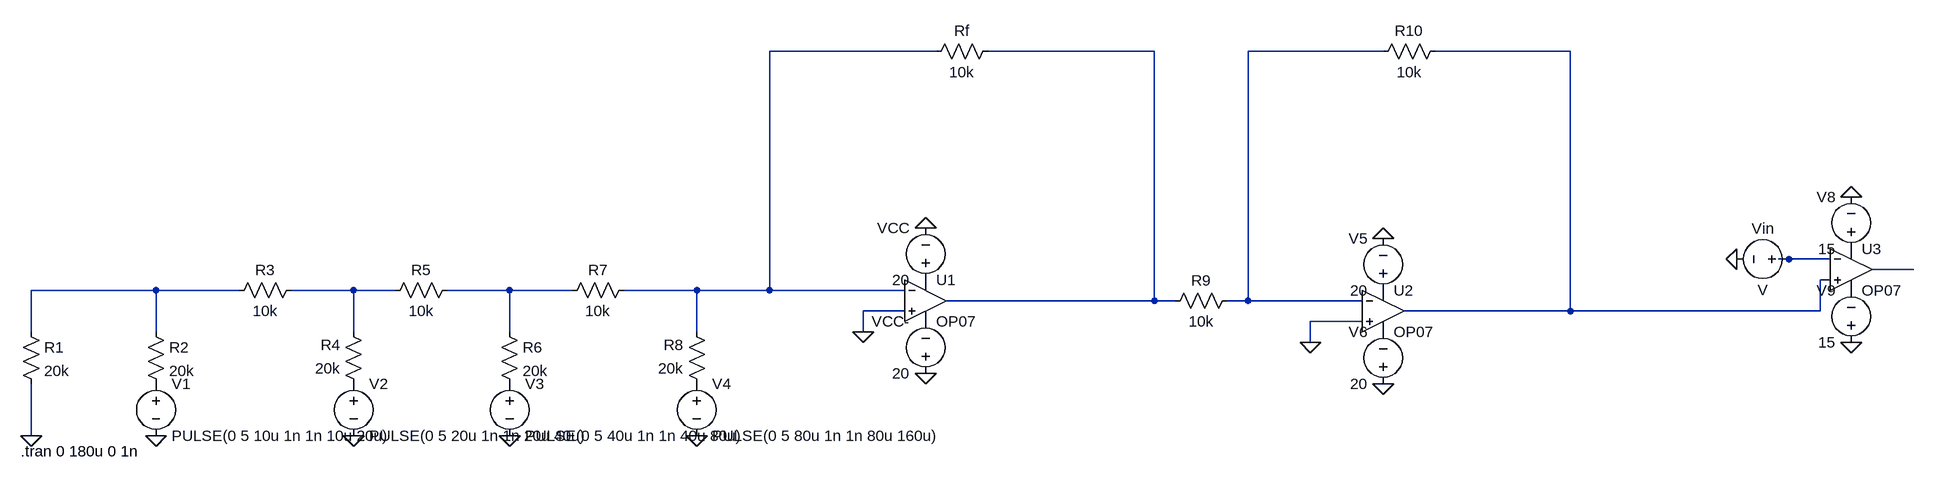
[diagram p0: schematic DAC.asc]
DAC.asc, the LTspice schematic file:
Version 4
SHEET 1 2836 680
WIRE 1328 -224 1072 -224
WIRE 1664 -224 1408 -224
WIRE 2016 -224 1808 -224
WIRE 2304 -224 2096 -224
WIRE 2640 96 2624 96
WIRE 2704 96 2640 96
WIRE 2832 112 2768 112
WIRE 2704 128 2688 128
WIRE 128 144 -64 144
WIRE 256 144 128 144
WIRE 432 144 336 144
WIRE 496 144 432 144
WIRE 672 144 576 144
WIRE 768 144 672 144
WIRE 960 144 848 144
WIRE 1072 144 1072 -224
WIRE 1072 144 960 144
WIRE 1280 144 1072 144
WIRE 1664 160 1664 -224
WIRE 1664 160 1344 160
WIRE 1696 160 1664 160
WIRE 1808 160 1808 -224
WIRE 1808 160 1776 160
WIRE 1984 160 1808 160
WIRE 1280 176 1216 176
WIRE 2304 176 2304 -224
WIRE 2304 176 2048 176
WIRE 2688 176 2688 128
WIRE 2688 176 2304 176
WIRE 1984 192 1904 192
WIRE -64 208 -64 144
WIRE 128 208 128 144
WIRE 432 208 432 144
WIRE 672 208 672 144
WIRE 960 208 960 144
WIRE 1216 208 1216 176
WIRE 1904 224 1904 192
WIRE -64 368 -64 288
FLAG -64 368 0
FLAG 1216 208 0
FLAG 1312 48 0
FLAG 1312 272 0
FLAG 128 368 0
FLAG 432 368 0
FLAG 672 368 0
FLAG 960 368 0
FLAG 1904 224 0
FLAG 2016 64 0
FLAG 2016 288 0
FLAG 2736 0 0
FLAG 2736 224 0
FLAG 2560 96 0
DATAFLAG 1072 144 ""
DATAFLAG 1664 160 ""
DATAFLAG 672 144 ""
DATAFLAG 432 144 ""
DATAFLAG 128 144 ""
DATAFLAG 1664 160 ""
DATAFLAG 1664 160 ""
SYMBOL res -80 192 R0
SYMATTR InstName R1
SYMATTR Value 20k
SYMBOL res 112 192 R0
SYMATTR InstName R2
SYMATTR Value 20k
SYMBOL res 352 128 R90
WINDOW 0 0 56 VBottom 2
WINDOW 3 32 56 VTop 2
SYMATTR InstName R3
SYMATTR Value 10k
SYMBOL res 448 304 R180
WINDOW 0 36 76 Left 2
WINDOW 3 36 40 Left 2
SYMATTR InstName R4
SYMATTR Value 20k
SYMBOL res 480 160 R270
WINDOW 0 32 56 VTop 2
WINDOW 3 0 56 VBottom 2
SYMATTR InstName R5
SYMATTR Value 10k
SYMBOL res 656 192 R0
SYMATTR InstName R6
SYMATTR Value 20k
SYMBOL res 864 128 R90
WINDOW 0 0 56 VBottom 2
WINDOW 3 32 56 VTop 2
SYMATTR InstName R7
SYMATTR Value 10k
SYMBOL res 976 304 R180
WINDOW 0 36 76 Left 2
WINDOW 3 36 40 Left 2
SYMATTR InstName R8
SYMATTR Value 20k
SYMBOL OpAmps\\OP07 1312 96 R0
SYMATTR InstName U1
SYMBOL voltage 1312 144 R180
WINDOW 0 24 96 Left 2
WINDOW 3 24 16 Left 2
SYMATTR InstName VCC
SYMATTR Value 20
SYMBOL voltage 1312 288 R180
WINDOW 0 24 96 Left 2
WINDOW 3 24 16 Left 2
SYMATTR InstName VCC-
SYMATTR Value 20
SYMBOL res 1424 -240 R90
WINDOW 0 0 56 VBottom 2
WINDOW 3 32 56 VTop 2
SYMATTR InstName Rf
SYMATTR Value 10k
SYMBOL voltage 128 272 R0
WINDOW 123 0 0 Left 0
WINDOW 39 0 0 Left 0
SYMATTR InstName V1
SYMATTR Value PULSE(0 5 10u 1n 1n 10u 20u)
SYMBOL voltage 432 272 R0
WINDOW 123 0 0 Left 0
WINDOW 39 0 0 Left 0
SYMATTR InstName V2
SYMATTR Value PULSE(0 5 20u 1n 1n 20u 40u)
SYMBOL voltage 672 272 R0
WINDOW 123 0 0 Left 0
WINDOW 39 0 0 Left 0
SYMATTR InstName V3
SYMATTR Value PULSE(0 5 40u 1n 1n 40u 80u)
SYMBOL voltage 960 272 R0
WINDOW 123 0 0 Left 0
WINDOW 39 0 0 Left 0
SYMATTR InstName V4
SYMATTR Value PULSE(0 5 80u 1n 1n 80u 160u)
SYMBOL OpAmps\\OP07 2016 112 R0
SYMATTR InstName U2
SYMBOL voltage 2016 160 R180
WINDOW 0 24 96 Left 2
WINDOW 3 24 16 Left 2
SYMATTR InstName V5
SYMATTR Value 20
SYMBOL voltage 2016 304 R180
WINDOW 0 24 96 Left 2
WINDOW 3 24 16 Left 2
SYMATTR InstName V6
SYMATTR Value 20
SYMBOL res 1792 144 R90
WINDOW 0 0 56 VBottom 2
WINDOW 3 32 56 VTop 2
SYMATTR InstName R9
SYMATTR Value 10k
SYMBOL res 2112 -240 R90
WINDOW 0 0 56 VBottom 2
WINDOW 3 32 56 VTop 2
SYMATTR InstName R10
SYMATTR Value 10k
SYMBOL OpAmps\\OP07 2736 48 R0
SYMATTR InstName U3
SYMBOL voltage 2736 96 R180
WINDOW 0 24 96 Left 2
WINDOW 3 24 16 Left 2
WINDOW 123 0 0 Left 0
WINDOW 39 0 0 Left 0
SYMATTR InstName V8
SYMATTR Value 15
SYMBOL voltage 2736 240 R180
WINDOW 0 24 96 Left 2
WINDOW 3 24 16 Left 2
SYMATTR InstName V9
SYMATTR Value 15
SYMBOL voltage 2656 96 R90
WINDOW 0 -32 56 VBottom 2
WINDOW 3 32 56 VTop 2
SYMATTR InstName Vin
TEXT -80 392 Left 2 !.tran 0 180u 0 1n

The netlist it stands for:
* DAC.asc
R1 N007 0 20k
R2 N007 P001 20k
R3 N008 N007 10k
R4 P002 N008 20k
R5 N008 N009 10k
R6 N009 P003 20k
R7 N001 N009 10k
R8 P004 N001 20k
XU1 0 N001 P005 P006 N002 LT1001  ; OP07, pins In+ In- V+ V- OUT
VCC P005 0 20
VCC- 0 P006 20
Rf N002 N001 10k
V1 P001 0 PULSE(0 5 10u 1n 1n 10u 20u)
V2 P002 0 PULSE(0 5 20u 1n 1n 20u 40u)
V3 P003 0 PULSE(0 5 40u 1n 1n 40u 80u)
V4 P004 0 PULSE(0 5 80u 1n 1n 80u 160u)
XU2 0 N003 P007 P008 N004 LT1001  ; OP07, pins In+ In- V+ V- OUT
V5 P007 0 20
V6 0 P008 20
R9 N003 N002 10k
R10 N004 N003 10k
XU3 N004 N005 P009 P010 N006 LT1001  ; OP07, pins In+ In- V+ V- OUT
V8 P009 0 15
V9 0 P010 15
Vin N005 0 V
.tran 0 180u 0 1n
.lib LTC.lib
.backanno
.end